# EasyEDA schematic Ouroboros EeasyEDA 1.2.json

## Sheets
1 Leds: TITLE: Ouroboros Looper / Leds; REV: 1.2; Date: 1 Nov 2026; Sheet: 3/4; Drawn By: Alex Kulinchenko; Company: a.kulinchenko8@gmail.com
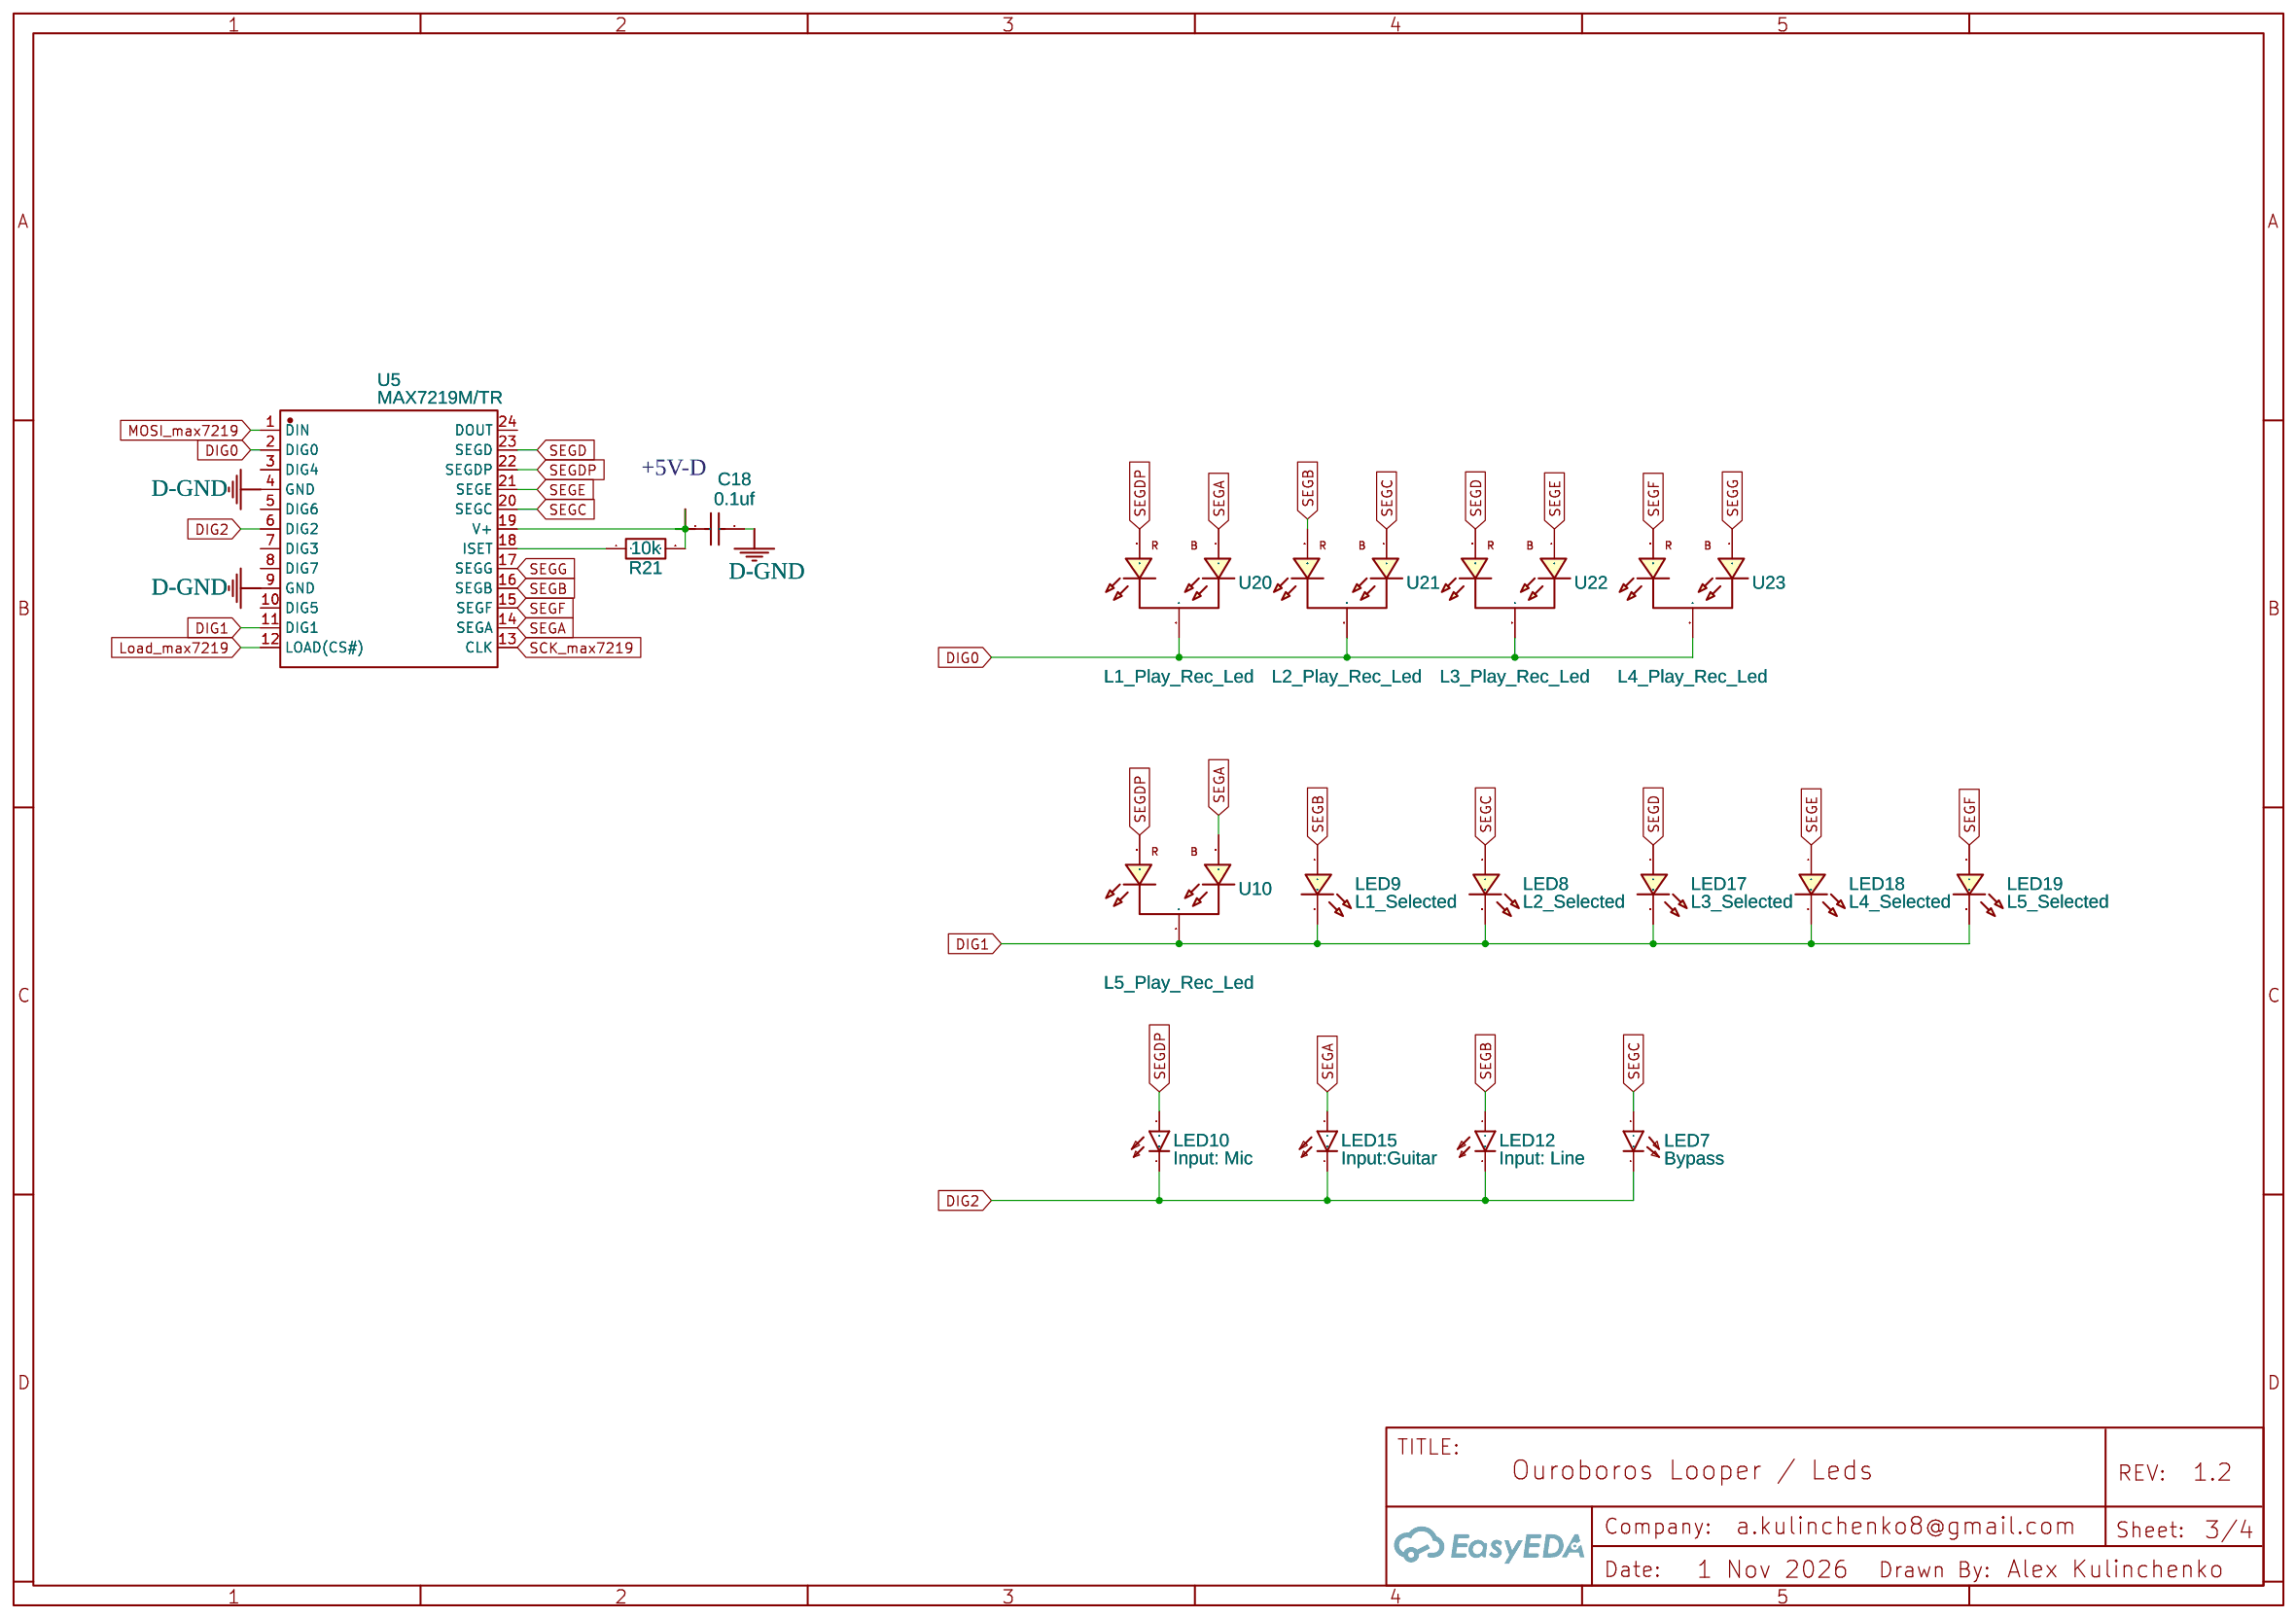
[diagram p0: Leds]
2 In&Out: TITLE: Ouroboros Looper / In and Out; Sheet: 2/4
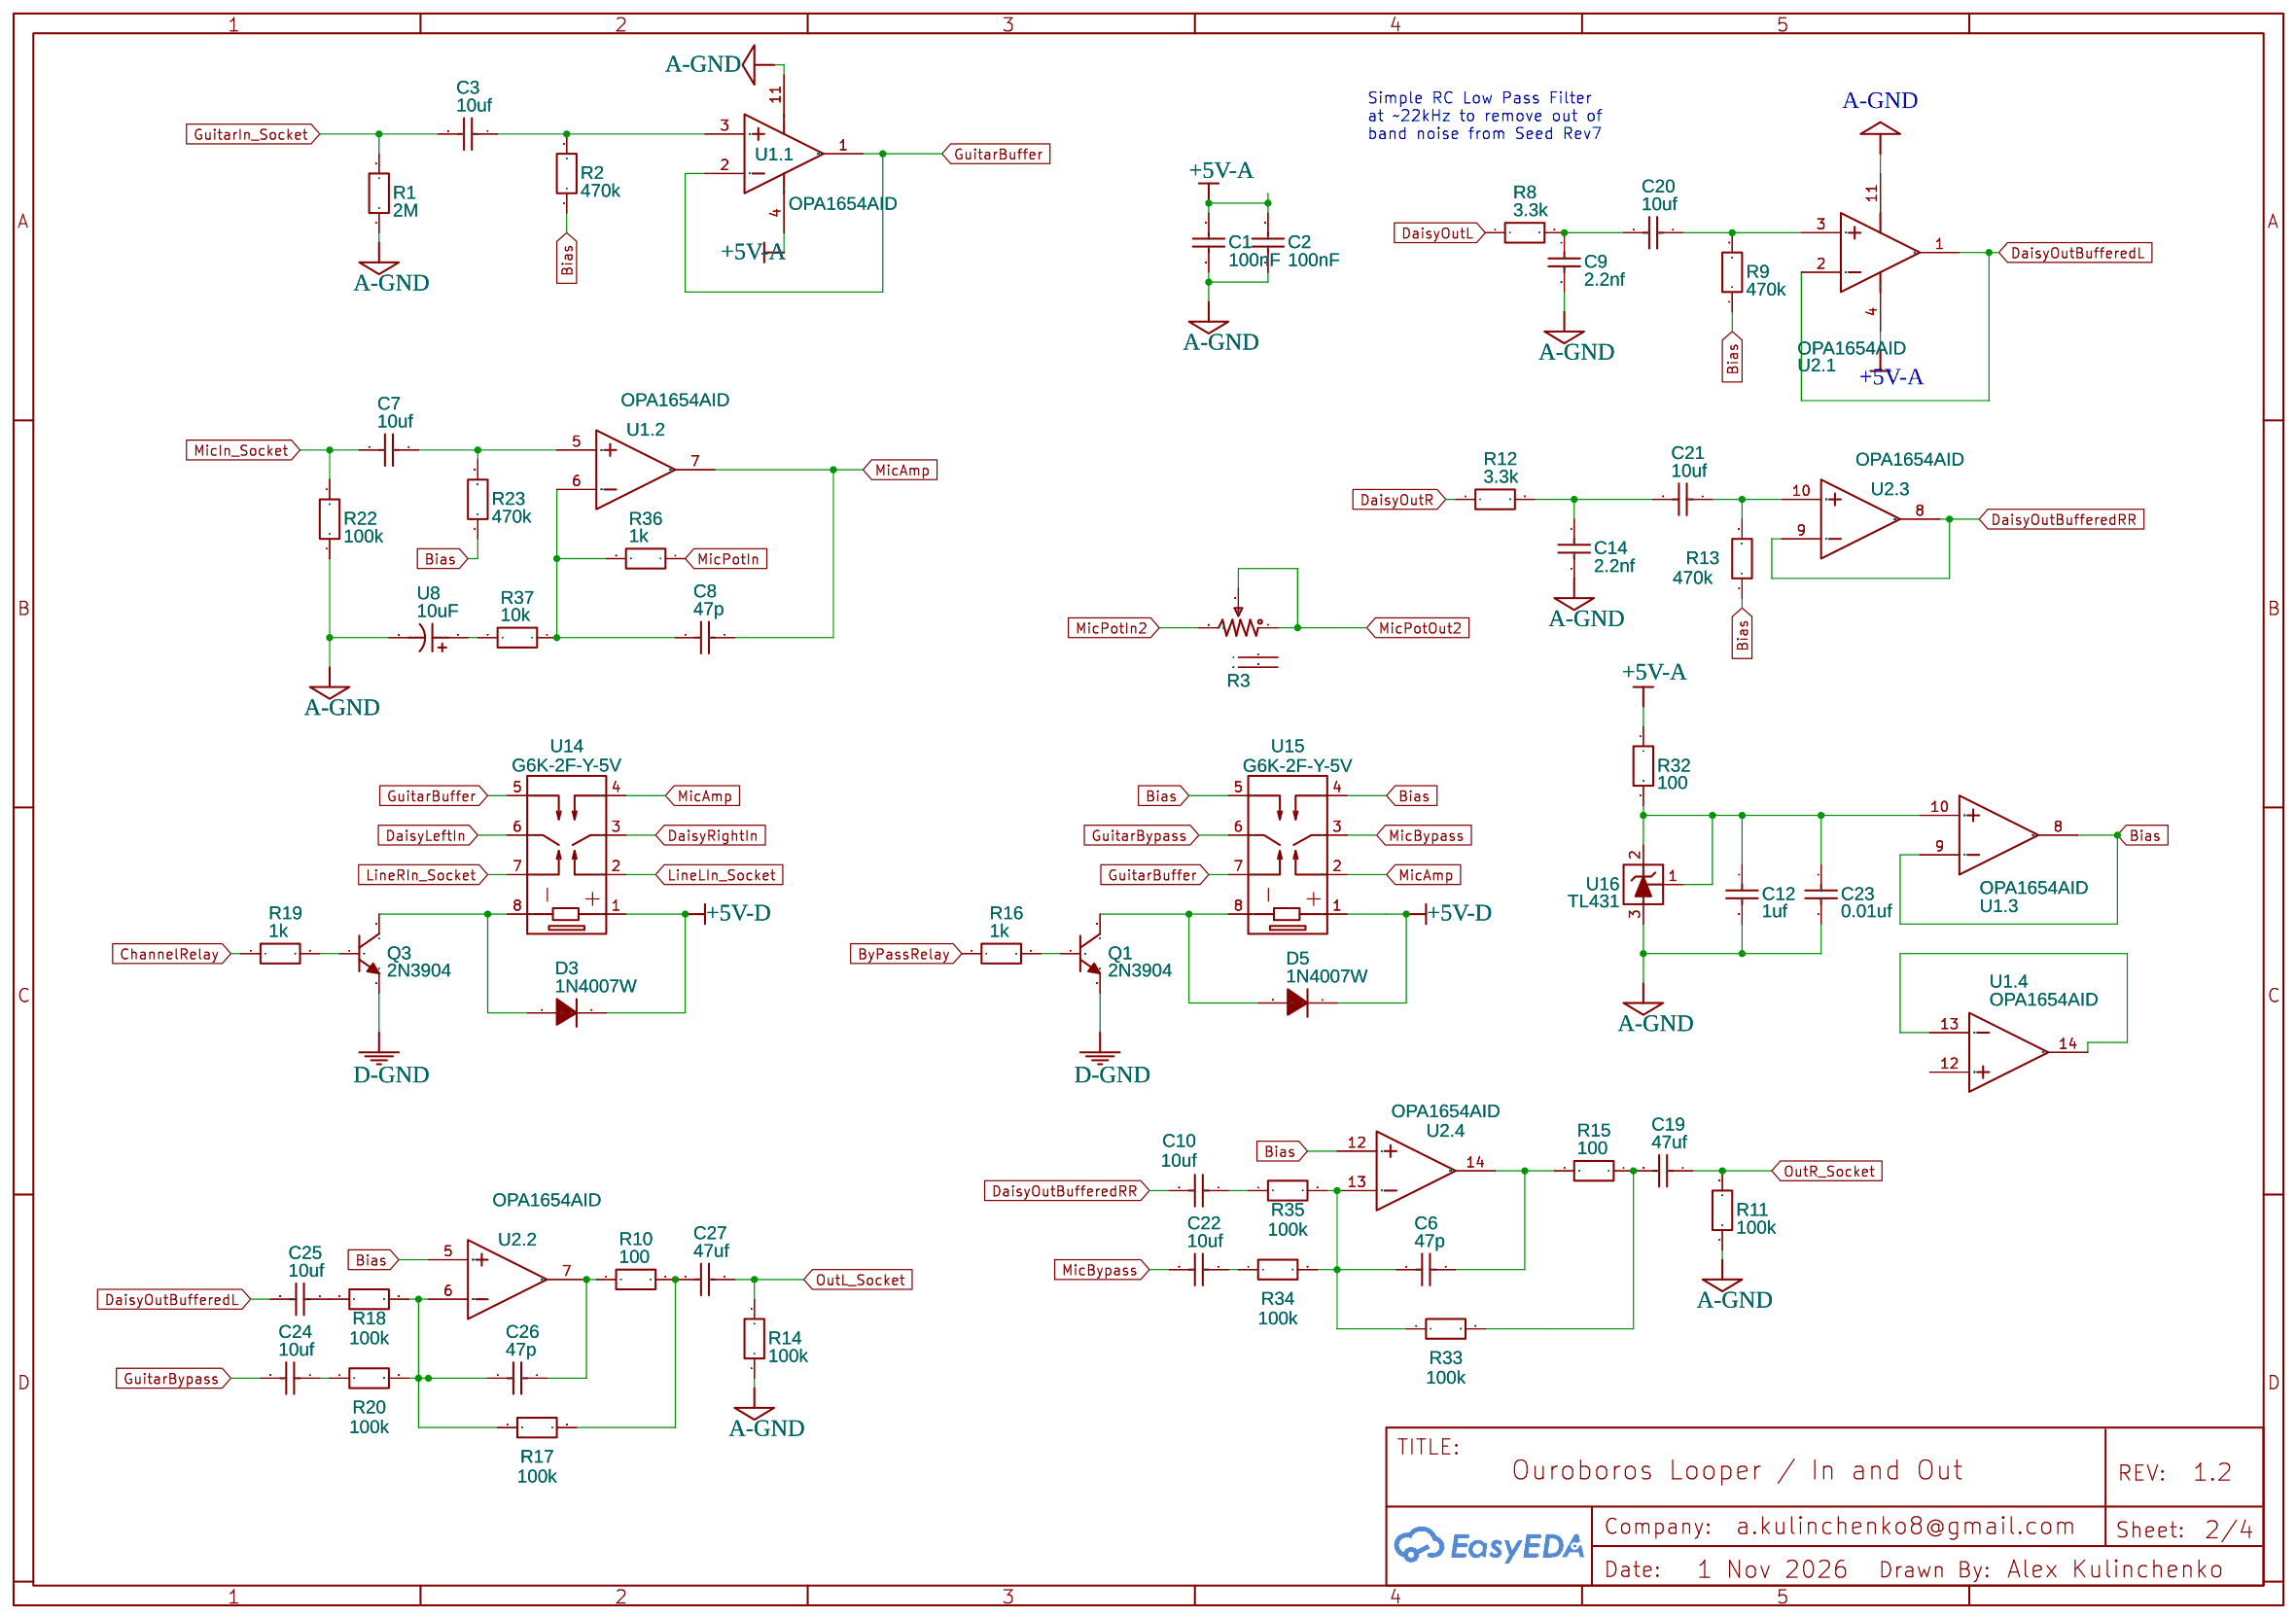
[diagram p1: In&Out]
3 Main: TITLE: Ouroboros Looper / Main; Sheet: 1/4
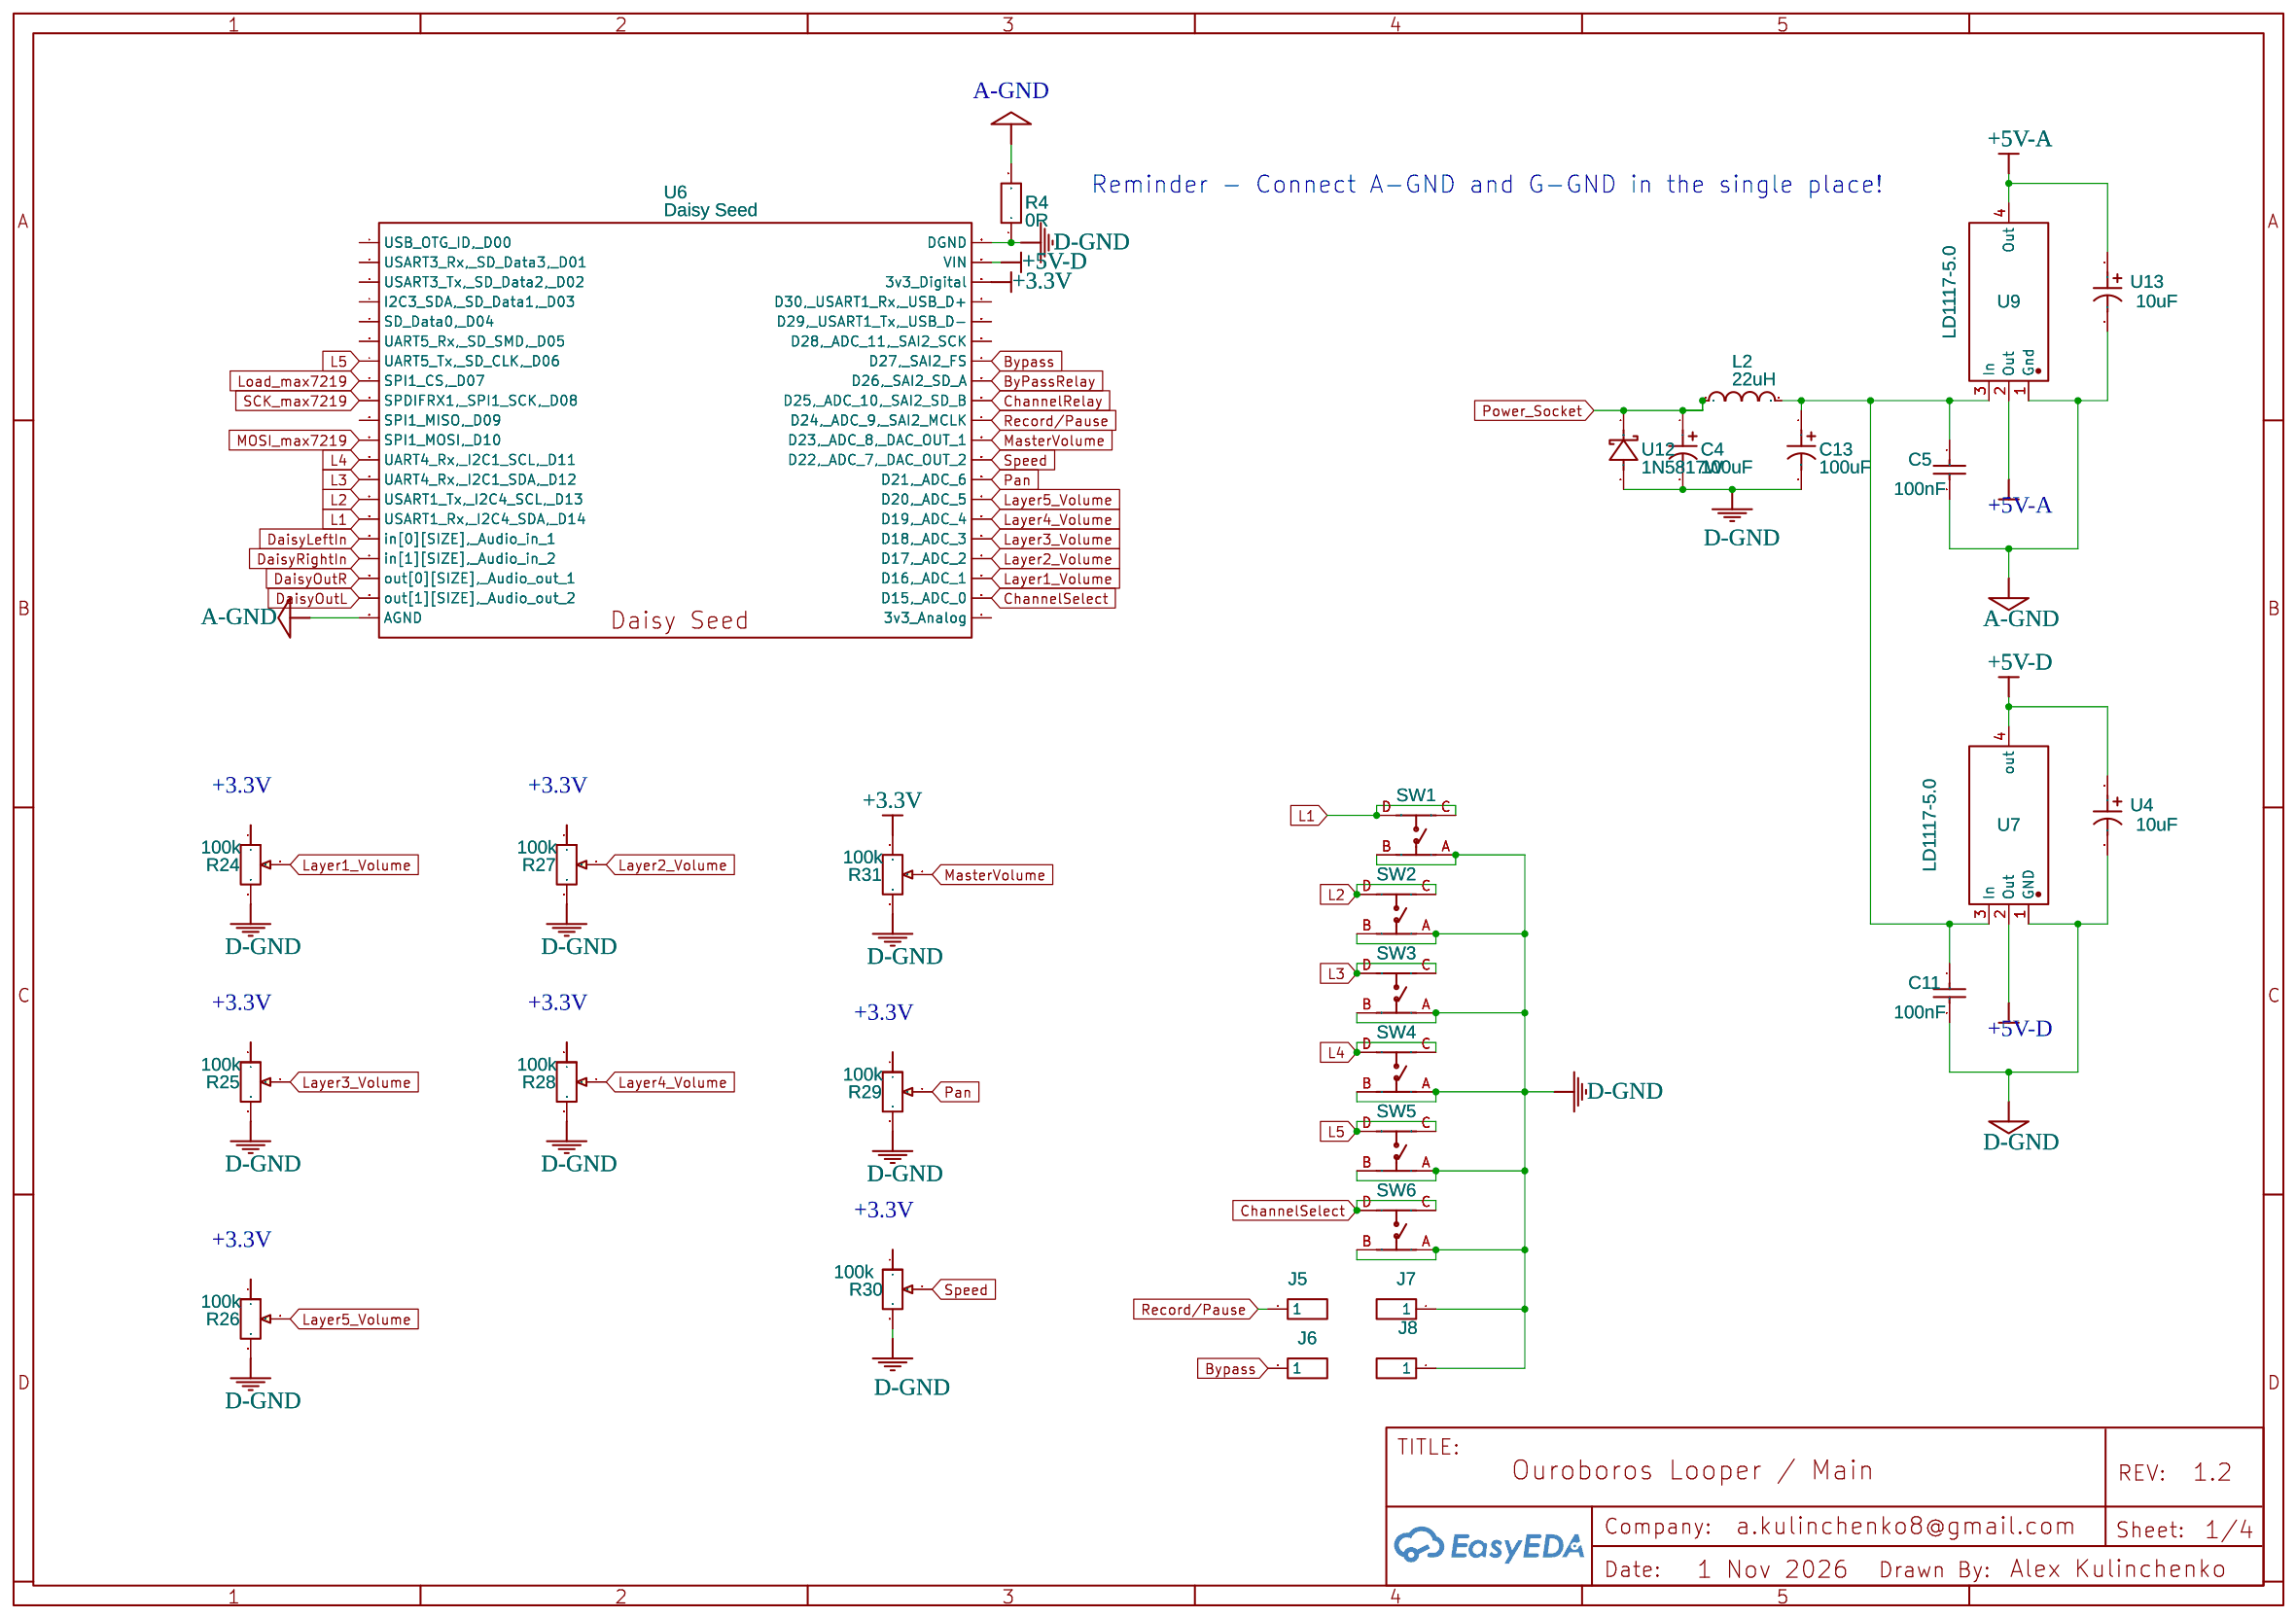
[diagram p2: Main]
4 Sockets: TITLE: Ouroboros Looper / Sockets; Sheet: 4/4
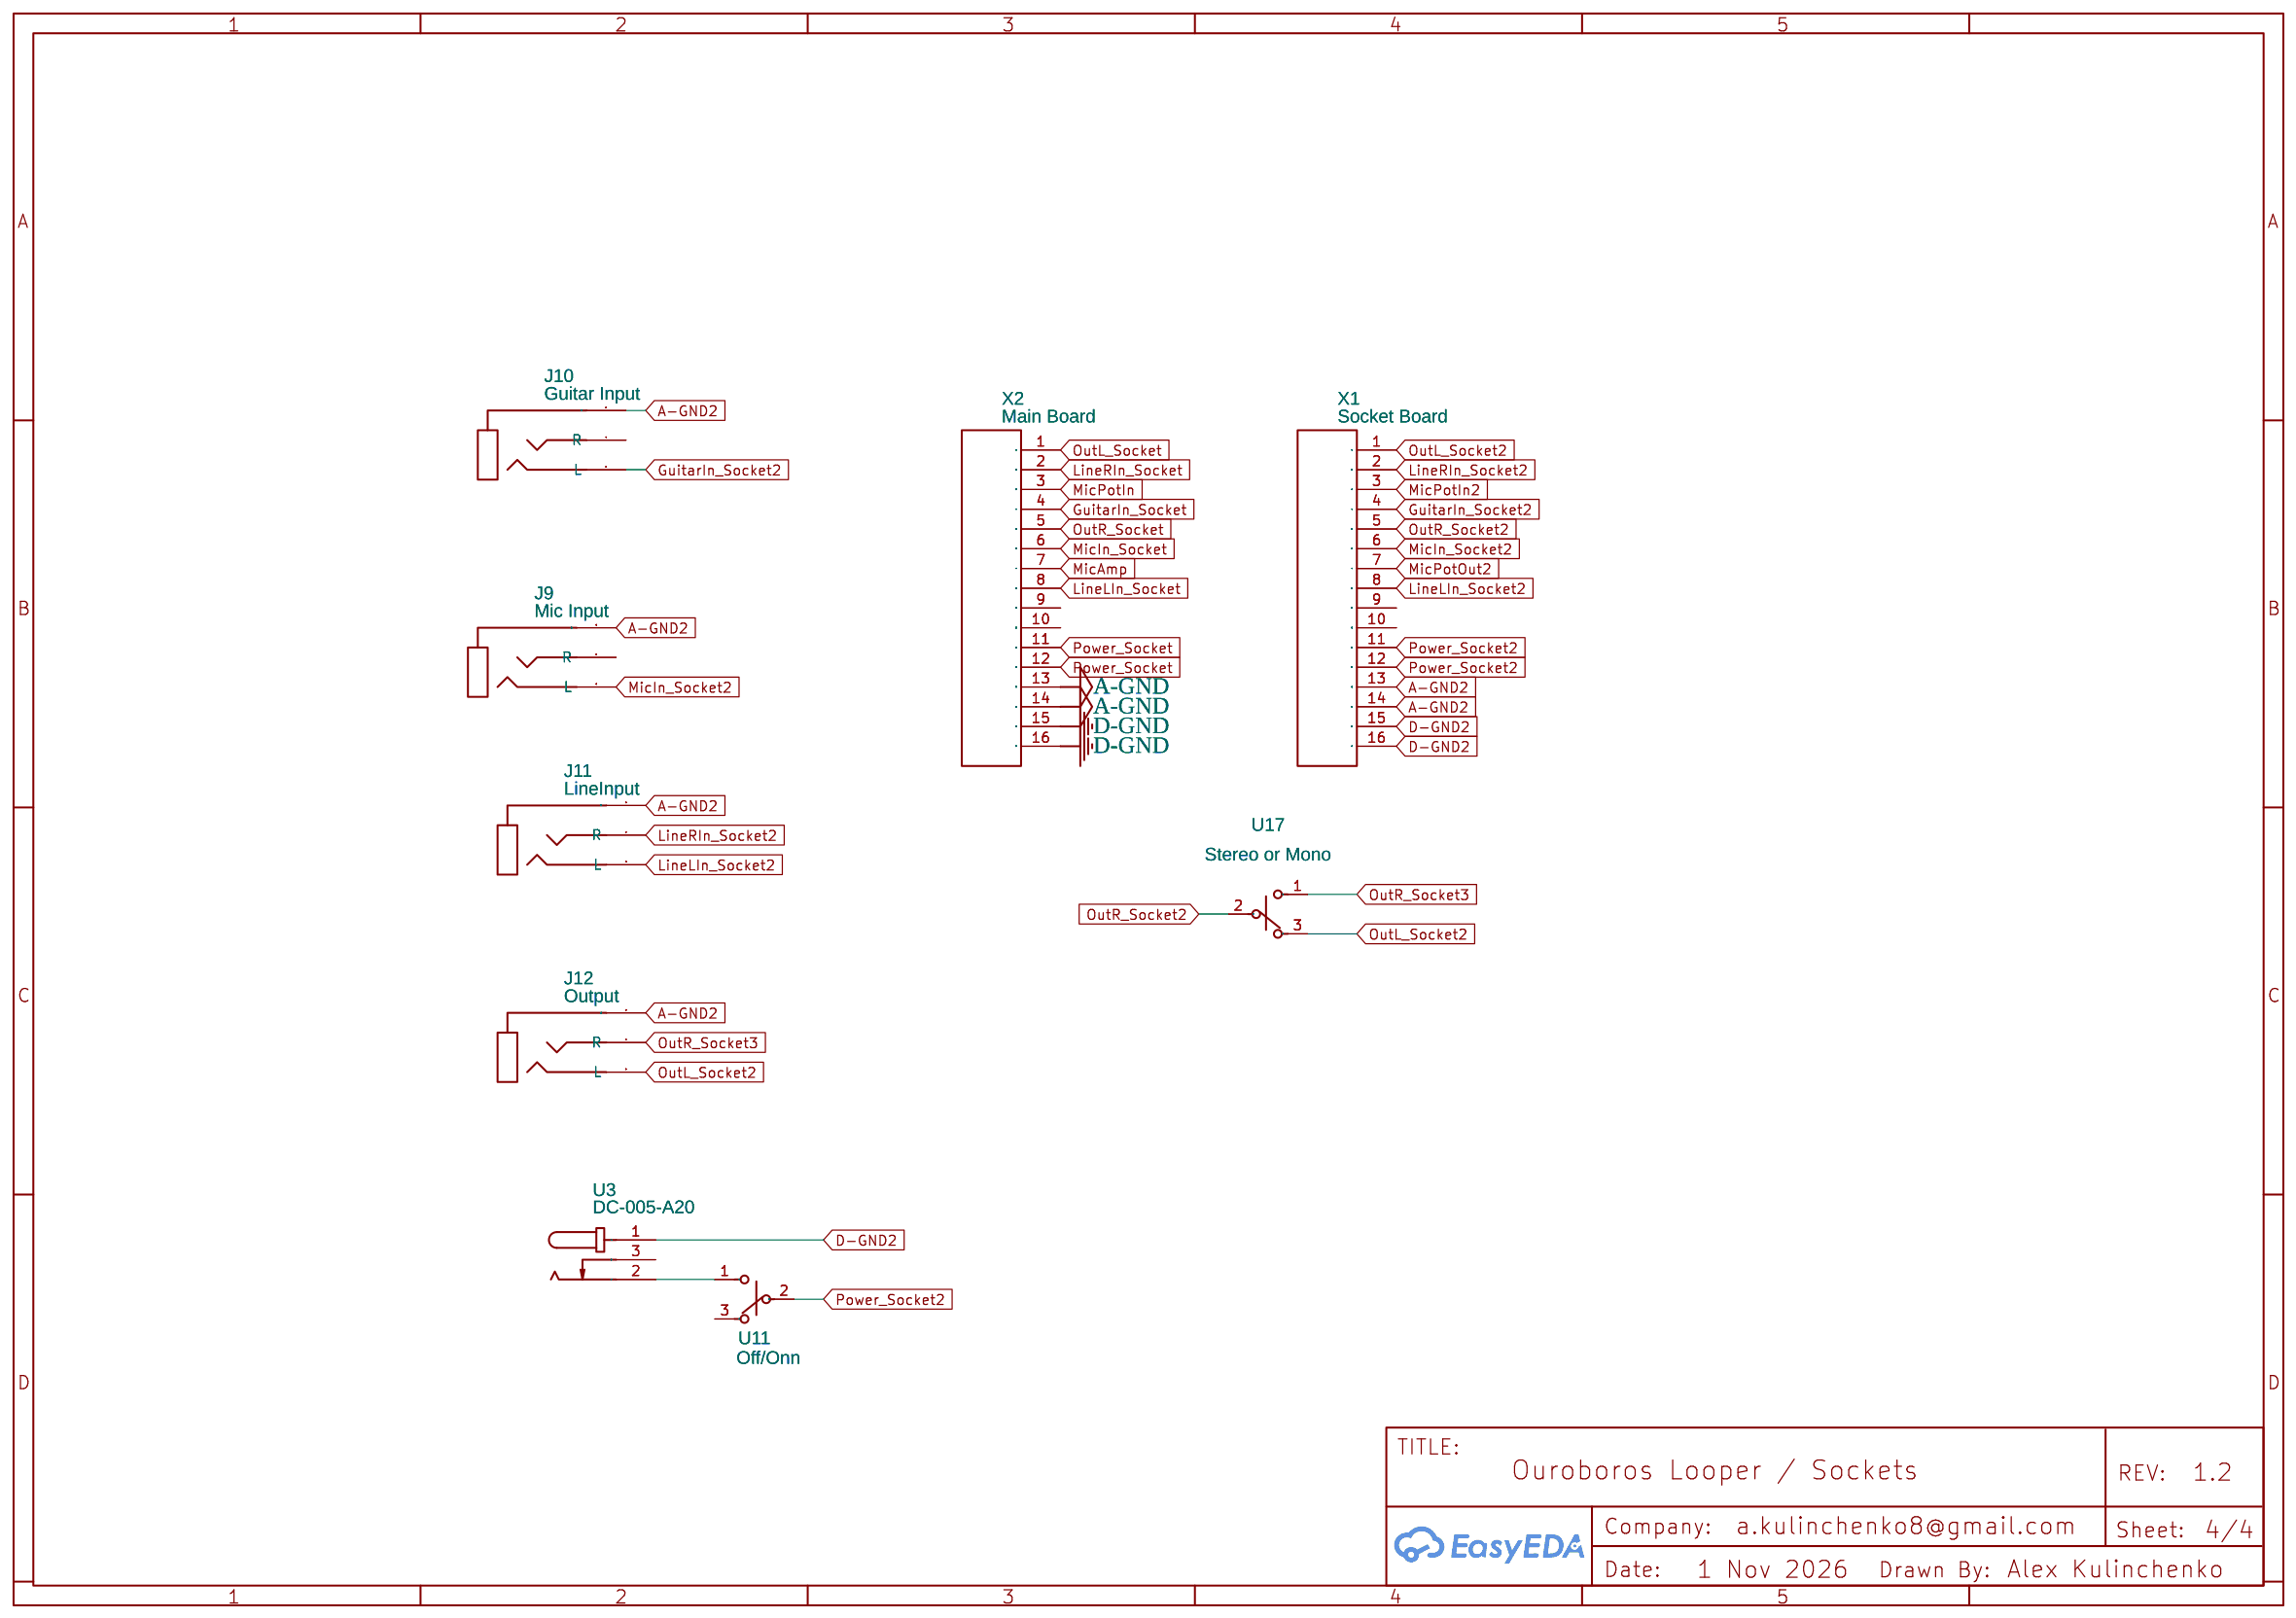
[diagram p3: Sockets]

## Parts
sheet In&Out
C1  100nF  [C0805]
C2  100nF  [C0805]
C3  10uf  [C0805]
C6  47p  [C0805]
C7  10uf  [C0805]
C8  47p  [C0805]
C9  2.2nf  [C0805]
C10  10uf  [C0805]
C12  1uf  [C0805]
C14  2.2nf  [C0805]
C19  47uf  [C0805]
C20  10uf  [C0805]
C21  10uf  [C0805]
C22  10uf  [C0805]
C23  0.01uf  [C0805]
C24  10uf  [C0805]
C25  10uf  [C0805]
C26  47p  [C0805]
C27  47uf  [C0805]
D3  1N4007W  [SOD-123FL_L2.7-W1.8-LS3.8-RD]
D5  1N4007W  [SOD-123FL_L2.7-W1.8-LS3.8-RD]
Q1  2N3904  [SOT-23-3_L3.0-W1.7-P0.95-LS2.9-BR]
Q3  2N3904  [SOT-23-3_L3.0-W1.7-P0.95-LS2.9-BR]
R1  2M  [R0805]
R2  470k  [R0805]
R3  DIP-VR-3P-2.54MM-RV09  [RES-ADJ-TH_DIP-VR-3P-2.54MM-RV09]
R8  3.3k  [R0805]
R9  470k  [R0805]
R10  100  [R0805]
R11  100k  [R0805]
R12  3.3k  [R0805]
R13  470k  [R0805]
R14  100k  [R0805]
R15  100  [R0805]
R16  1k  [R0805]
R17  100k  [R0805]
R18  100k  [R0805]
R19  1k  [R0805]
R20  100k  [R0805]
R22  100k  [R0805]
R23  470k  [R0805]
R32  100  [R0805]
R33  100k  [R0805]
R34  100k  [R0805]
R35  100k  [R0805]
R36  1k  [R0805]
R37  10k  [R0805]
U1  OPA1654AID  [SOIC-14_L8.6-W3.9-P1.27-LS6.0-BL]  (sections 1,2,3,4)
U2  OPA1654AID  [SOIC-14_L8.6-W3.9-P1.27-LS6.0-BL]  (sections 1,2,3,4)
U8  10uF  [CAP-SMD_BD4.0-L4.3-W4.3-LS5.0-FD]
U14  G6K-2F-Y-5V  [RELAY-SMD_G6K-2F-Y]
U15  G6K-2F-Y-5V  [RELAY-SMD_G6K-2F-Y]
U16  TL431  [SOT-23-3_L3.0-W1.6-P1.90-LS2.8-BR]
sheet Leds
C18  0.1uf  [C0805]
LED7  Bypass  [LED_LED3MM]
LED8  L2_Selected  [LED-TH_BD5.0_RED]
LED9  L1_Selected  [LED-TH_BD5.0_RED]
LED10  Input: Mic  [LED_LED3MM]
LED12  Input: Line  [LED_LED3MM]
LED15  Input:Guitar  [LED_LED3MM]
LED17  L3_Selected  [LED-TH_BD5.0_RED]
LED18  L4_Selected  [LED-TH_BD5.0_RED]
LED19  L5_Selected  [LED-TH_BD5.0_RED]
R21  10k  [R0805]
U5  MAX7219M/TR  [SOP-24_L15.4-W7.5-P1.27-LS10.4-BL]
U10  L5_Play_Rec_Led  [DUAL LED COMMON CATHODE R/B]
U20  L1_Play_Rec_Led  [DUAL LED COMMON CATHODE R/B]
U21  L2_Play_Rec_Led  [DUAL LED COMMON CATHODE R/B]
U22  L3_Play_Rec_Led  [DUAL LED COMMON CATHODE R/B]
U23  L4_Play_Rec_Led  [DUAL LED COMMON CATHODE R/B]
sheet Main
C4  100uF  [CAP-SMD_BD6.3-L6.6-W6.6-LS7.2-FD]
C5  100nF  [C0805]
C11  100nF  [C0805]
C13  100uF  [CAP-SMD_BD6.3-L6.6-W6.6-LS7.2-FD]
J5  HDR-M-2.54_1x1  [HDR-M-2.54_1X1]
J6  HDR-M-2.54_1x1  [HDR-M-2.54_1X1]
J7  HDR-M-2.54_1x1  [HDR-M-2.54_1X1]
J8  HDR-M-2.54_1x1  [HDR-M-2.54_1X1]
L2  22uH  [IND-SMD_L5.0-W5.0_LVS505040]
R4  0R  [R1206]
R24  100k  [9MM_SNAP-IN_POT]
R25  100k  [9MM_SNAP-IN_POT]
R26  100k  [9MM_SNAP-IN_POT]
R27  100k  [9MM_SNAP-IN_POT]
R28  100k  [9MM_SNAP-IN_POT]
R29  100k  [9MM_SNAP-IN_POT]
R30  100k  [9MM_SNAP-IN_POT]
R31  100k  [9MM_SNAP-IN_POT]
SW1  L1  [SW-TH_SH-6X6X4.3H-CJ]
SW2  L2  [SW-TH_SH-6X6X4.3H-CJ]
SW3  L3  [SW-TH_SH-6X6X4.3H-CJ]
SW4  L4  [SW-TH_SH-6X6X4.3H-CJ]
SW5  L5  [SW-TH_SH-6X6X4.3H-CJ]
SW6  Channel  [SW-TH_SH-6X6X4.3H-CJ]
U4  10uF  [CAP-SMD_BD5.0-L5.3-W5.3-LS5.5-FD]
U6  Daisy Seed  [DAISY_SEED]
U7  LD1117-5.0  [SOT-223_L6.7-W3.5-P2.30-BR]
U9  LD1117-5.0  [SOT-223_L6.7-W3.5-P2.30-BR]
U12  1N5817W  [SOD-123_L2.8-W1.6-LS3.7-RD]
U13  10uF  [CAP-SMD_BD5.0-L5.3-W5.3-LS5.5-FD]
sheet Sockets
J9  Mic Input  [ST-008 SHORT]
J10  Guitar Input  [ST-008 SHORT]
J11  LineInput  [ST-008 SHORT]
J12  Output  [ST-008 SHORT]
U3  DC-005-A20  [DC-IN-TH_DC-005-A200]
U11  Off/Onn  [MTS-102-C4 ON-ON SPDT 3P]
U17  Stereo or Mono  [MTS-102-C4 ON-ON SPDT 3P]
X1  Socket Board  [IDC 16PIN]
X2  Main Board  [IDC 16PIN]

## Library data of the parts
C1-C3 C5-C12 C14 C18-C27 = 100nF: Supplier: LCSC; Manufacturer: ReliaPro; Manufacturer Part: CT4-0805Y104M500; Contributor: LCSC; Supplier Part: C46756
D3 D5 = 1N4007W: Supplier: LCSC; Manufacturer: 晶导微电子; Supplier Part: C108803; JLCPCB Part Class: Extended Part
Q1 Q3 = 2N3904S-HXY: Supplier: LCSC; Supplier Part: C46682376; Manufacturer: HXY MOSFET(华轩阳电子); JLCPCB Part Class: Extended Part; Contributor: lcsc
R1 = R_AXIAL-0.4_EU: Supplier Part: C325853; Supplier: LCSC; Contributor: LCEDA_Lib; Manufacturer Part: RMC 0805 2M J N; Manufacturer: Tyohm(幸亚电阻)
R2 R9 R13 R23 = R_AXIAL-0.4_EU: Supplier Part: C136922; Supplier: LCSC; Contributor: LCEDA_Lib; Manufacturer Part: RT0805BRD07470KL; Manufacturer: YAGEO(国巨)
R3 = DIP-VR-3P-2.54MM-RV09: Contributor: lcsc; Supplier: LCSC; Supplier Part: C9900014641; Manufacturer: null; JLCPCB Part Class: Extended Part
R8 R12 = R_AXIAL-0.4_EU: Supplier Part: C269541; Supplier: LCSC; Contributor: LCEDA_Lib; Manufacturer Part: RMC08053.3K1%N; Manufacturer: Tyohm(幸亚电阻)
R10 R15 R32 = R_AXIAL-0.4_EU: Supplier Part: C3008930; Supplier: LCSC; Contributor: LCEDA_Lib; Manufacturer Part: CRCW0805100RJNEAC; Manufacturer: VISHAY(威世)
R11 R14 R17 R18 R20 R22 R33-R35 = R_AXIAL-0.4_EU: Supplier Part: C328379; Supplier: LCSC; Contributor: LCEDA_Lib; Manufacturer Part: AECR0805F100KK9; Manufacturer: RESI(开步睿思)
R16 R19 R36 R37 = R_AXIAL-0.4_EU: Supplier Part: C17513; Supplier: LCSC; Contributor: LCEDA_Lib; Manufacturer Part: 0805W8F1001T5E; Manufacturer: UNI-ROYAL(厚声)
U1 U2 = OPA1654AID: subpart_no: 1; Supplier: LCSC; Supplier Part: C2878588; Manufacturer: TI(德州仪器); JLCPCB Part Class: Extended Part
U8 = 126RV0157: Supplier: LCSC; Supplier Part: C7461288; Manufacturer: KNSCHA(科尼盛); JLCPCB Part Class: Extended Part; Contributor: lcsc
U14 U15 = G6K-2F-Y-5V_C2982926: Contributor: lcsc; Supplier: LCSC; Supplier Part: C2982926; Manufacturer: OMRON(欧姆龙); JLCPCB Part Class: Extended Part
U16 = TL431-SOT-23: Supplier: LCSC; Supplier Part: C50229486; Manufacturer: DDF(鼎德丰); Contributor: lcsc; JLCPCB Part Class: Extended Part
LED7 LED10 LED12 LED15 = LED_LED3MM: Contributor: titiyanee.saw
LED8 LED9 LED17-LED19 = LED-TH-5mm_R: Manufacturer: EVERLIGHT(台湾亿光); Manufacturer Part: 333-2SURD/S530-A3; Supplier Part: C87271; Supplier: LCSC; Contributor: LCEDA_Lib
R21 = R_AXIAL-0.4_EU: Supplier Part: C3016734; Supplier: LCSC; Contributor: LCEDA_Lib; Manufacturer Part: SCR0805F10K; Manufacturer: VO(翔胜)
U5 = MAX7219M/TR: Supplier: LCSC; Supplier Part: C6705351; Manufacturer: HGSEMI(华冠); JLCPCB Part Class: Extended Part; Contributor: lcsc
U10 U20-U23 = DUAL LED COMMON CATHODE R/B: Contributor: jmsfcx
C4 C13 = RVT100UF16V67RV0016: Contributor: LCSC; Supplier: LCSC; Supplier Part: C2887276; Manufacturer: KNSCHA(科尼盛); JLCPCB Part Class: Extended Part
J5-J8 = HDR-M-2.54_1x1: Supplier Part: C81276; Supplier: LCSC; Contributor: LCEDA_Lib
L2 = LVS505020-220M-N: Supplier: LCSC; Manufacturer: Chilisin(奇力新); Supplier Part: C142123; JLCPCB Part Class: Extended Part
R4 = R_1206_EU: Supplier Part: C5127787; Supplier: LCSC; Contributor: LCEDA_Lib; Manufacturer Part: HoT1206D-0R; Manufacturer: Milliohm(毫欧)
R24-R31 = R_3386P_EU: Supplier Part: C5140188; Supplier: LCSC; Manufacturer Part: SCR0805J10K; Contributor: LCEDA_Lib; Value(Ω): 10K; Manufacturer: VO(翔胜)
SW1-SW6 = SH-6X6X4.3H-CJ: Supplier: LCSC; Supplier Part: C42416242; Manufacturer: SHOU HAN(首韩); Contributor: lcsc; JLCPCB Part Class: Extended Part
U4 U13 = VZ1V100MC054000CE0: Supplier: LCSC; Supplier Part: C2912512; Manufacturer: HUAWEI(华威集团); Contributor: lcsc; JLCPCB Part Class: Extended Part
U6 = Daisy Seed: Contributor: jjmens
U7 U9 = LD1117-5.0: Contributor: LCSC; Supplier: LCSC; Supplier Part: C347230; Manufacturer: UMW(友台半导体); JLCPCB Part Class: Extended Part
U12 = 1N5817W_C19184667: Supplier: LCSC; Supplier Part: C19184667; Manufacturer: XCH(旭昌辉); Contributor: lcsc; JLCPCB Part Class: Extended Part
J9-J12 = ST-008: Contributor: bo4onokx
U3 = DC-005-A20: Supplier: LCSC; Supplier Part: C19077752; Manufacturer: Yuandi(元迪); Contributor: lcsc; JLCPCB Part Class: Extended Part
U11 U17 = MTS-102: Manufacturer: НЕТ; Supplier Part: НЕТ; link: НЕТ; Contributor: evgeniymaster
X1 X2 = IDC_16PIN_THT COPY: Manufacturer: CONNFLY; Manufacturer Part: ZL231-14PG; Supplier: TME; Supplier Part: ZL231-14PG; Contributor: michalklis

## Nets
+3.3V: R24.1 R25.1 R26.1 R27.1 R28.1 R29.1 R30.1 R31.1 U6.38(3v3 Digital)
+5V-A: C1.2 C2.2 R32.1 U1.4(V+) U2.4(V+) U9.2(Out) U9.4(Out) U13.1
+5V-D: C18.1 D3.1(K) D5.1(K) R21.2 U4.1 U5.19(V+) U6.39(VIN) U7.2(Out) U7.4(out) U14.1 U15.1
A-GND: C1.1 C2.1 C5.2 C9.2 C12.2 C14.2 C23.2 R1.1 R4.2 R11.1 R14.1 R22.1 U1.11(V-) U2.11(V-) U6.20(AGND) U8.2 U9.1(Gnd) U13.2 U16.3(A) X2.13 X2.14
A-GND2: J9.3(Gnd) J10.3(Gnd) J11.3(Gnd) J12.3(Gnd) X1.13 X1.14
Bias: R2.1 R9.1 R13.1 R23.1 U1.8(OUT C) U1.9(IN C-) U2.5(IN B+) U2.12(IN D+) U15.4 U15.5
Bypass: J6.1 U6.34(D27, SAI2 FS)
ByPassRelay: R16.1 U6.33(D26, SAI2 SD A)
ChannelRelay: R19.1 U6.32(D25, ADC 10, SAI2 SD B)
ChannelSelect: SW6.C SW6.D U6.22(D15, ADC 0)
D-GND: C4.2 C11.2 C13.2 C18.2 J7.1 J8.1 Q1.2(E) Q3.2(E) R4.1 R24.3 R25.3 R26.3 R27.3 R28.3 R29.3 R30.3 R31.3 SW1.A SW1.B SW2.A SW2.B SW3.A SW3.B SW4.A SW4.B SW5.A SW5.B SW6.A SW6.B U4.2 U5.4(GND) U5.9(GND) U6.40(DGND) U7.1(GND) U12.2(A) X2.15(14) X2.16(14)
D-GND2: U3.1 X1.15(14) X1.16(14)
DaisyLeftIn: U6.16(in[0][SIZE], Audio in 1) U14.6
DaisyOutBufferedL: C25.2 U2.1(OUT A) U2.2(IN A-)
DaisyOutBufferedRR: C10.2 U2.8(OUT C) U2.9(IN C-)
DaisyOutL: R8.1 U6.19(out[1][SIZE], Audio out 2)
DaisyOutR: R12.1 U6.18(out[0][SIZE], Audio out 1)
DaisyRightIn: U6.17(in[1][SIZE], Audio in 2) U14.3
DIG0: U5.2(DIG0) U20.2 U21.2 U22.2 U23.2
DIG1: LED8.2 LED9.2 LED17.2 LED18.2 LED19.2 U5.11(DIG1) U10.2
DIG2: LED7.K(C) LED10.K(C) LED12.K(C) LED15.K(C) U5.6(DIG2)
GuitarBuffer: U1.1(OUT A) U1.2(IN A-) U14.5 U15.7
GuitarBypass: C24.2 U15.6
GuitarIn_Socket: C3.2 R1.2 X2.4
GuitarIn_Socket2: J10.2(L) X1.4
L1: SW1.C SW1.D U6.15(USART1 Rx, I2C4 SDA, D14)
L2: SW2.C SW2.D U6.14(USART1 Tx, I2C4 SCL, D13)
L3: SW3.C SW3.D U6.13(UART4 Rx, I2C1 SDA, D12)
L4: SW4.C SW4.D U6.12(UART4 Rx, I2C1 SCL, D11)
L5: SW5.C SW5.D U6.7(UART5 Tx, SD CLK, D06)
Layer1_Volume: R24.2 U6.23(D16, ADC 1)
Layer2_Volume: R27.2 U6.24(D17, ADC 2)
Layer3_Volume: R25.2 U6.25(D18, ADC 3)
Layer4_Volume: R28.2 U6.26(D19, ADC 4)
Layer5_Volume: R26.2 U6.27(D20, ADC 5)
LineLIn_Socket: U14.2 X2.8
LineLIn_Socket2: J11.2(L) X1.8
LineRIn_Socket: U14.7 X2.2
LineRIn_Socket2: J11.1(R) X1.2
Load_max7219: U5.12(LOAD(CS#)) U6.8(SPI1 CS, D07)
MasterVolume: R31.2 U6.30(D23, ADC 8, DAC OUT 1)
MicAmp: C8.1 U1.7(OUT B) U14.4 U15.2 X2.7
MicBypass: C22.2 U15.3
MicIn_Socket: C7.2 R22.2 X2.6
MicIn_Socket2: J9.2(L) X1.6
MicPotIn: R36.1 X2.3
MicPotIn2: R3.3 X1.3
MicPotOut2: R3.1 R3.2 X1.7
MOSI_max7219: U5.1(DIN) U6.11(SPI1 MOSI, D10)
OutL_Socket: C27.1 R14.2 X2.1
OutL_Socket2: J12.2(L) U17.3 X1.1
OutR_Socket: C19.1 R11.2 X2.5
OutR_Socket2: U17.2 X1.5
OutR_Socket3: J12.1(R) U17.1
Pan: R29.2 U6.28(D21, ADC 6)
Power_Socket: C4.1 L2.1 U12.1(C) X2.11 X2.12
Power_Socket2: U11.2 X1.11 X1.12
Record/Pause: J5.1 U6.31(D24, ADC 9, SAI2 MCLK)
SCK_max7219: U5.13(CLK) U6.9(SPDIFRX1, SPI1 SCK, D08)
SEGA: LED15.A U5.14(SEGA) U10.1 U20.1
SEGB: LED9.1 LED12.A U5.16(SEGB) U21.3
SEGC: LED7.A LED8.1 U5.20(SEGC) U21.1
SEGD: LED17.1 U5.23(SEGD) U22.3
SEGDP: LED10.A U5.22(SEGDP) U10.3 U20.3
SEGE: LED18.1 U5.21(SEGE) U22.1
SEGF: LED19.1 U5.15(SEGF) U23.3
SEGG: U5.17(SEGG) U23.1
Speed: R30.2 U6.29(D22, ADC 7, DAC OUT 2)
Net-(C3-1): C3.1 R2.2 U1.3(IN A+)
Net-(C5-1): C5.1 C11.1 C13.1 L2.2 U7.3(In) U9.3(In)
Net-(C6-1): C6.1 R15.2 U2.14(OUT D)
Net-(C6-2): C6.2 R33.1 R34.2 R35.2 U2.13(IN D-)
Net-(C7-1): C7.1 R23.2 U1.5(IN B+)
Net-(C8-2): C8.2 R36.2 R37.1 U1.6(IN B-)
Net-(C9-1): C9.1 C20.2 R8.2
Net-(C10-1): C10.1 R35.1
Net-(C12-1): C12.1 C23.1 R32.2 U1.10(IN C+) U16.1(R) U16.2(C)
Net-(C14-1): C14.1 C21.2 R12.2
Net-(C19-2): C19.2 R15.1 R33.2
Net-(C20-1): C20.1 R9.2 U2.3(IN A+)
Net-(C21-1): C21.1 R13.2 U2.10(IN C+)
Net-(C22-1): C22.1 R34.1
Net-(C24-1): C24.1 R20.1
Net-(C25-1): C25.1 R18.1
Net-(C26-1): C26.1 R10.2 U2.7(OUT B)
Net-(C26-2): C26.2 R17.1 R18.2 R20.2 U2.6(IN B-)
Net-(C27-2): C27.2 R10.1 R17.2
Net-(D3-2): D3.2(A) Q3.3(C) U14.8
Net-(D5-2): D5.2(A) Q1.3(C) U15.8
Net-(Q1-1): Q1.1(B) R16.2
Net-(Q3-1): Q3.1(B) R19.2
Net-(R21-1): R21.1 U5.18(ISET)
Net-(R37-2): R37.2 U8.1
Net-(U1.4-13): U1.13(IN D-) U1.14(OUT D)
Net-(U3-2): U3.2 U11.1

Not connected (* = marked no-connect by the designer): J9 1(R); J10 1(R); R3 4 5; U1 12(IN D+); U3 3; U5 3(DIG4) 5(DIG6) 7(DIG3) 8(DIG7) 10(DIG5) 24(DOUT); U6 1(USB OTG ID, D00) 2(USART3 Rx, SD Data3, D01) 3(USART3 Tx, SD Data2, D02) 4(I2C3 SDA, SD Data1, D03) 5(SD Data0, D04) 6(UART5 Rx, SD SMD, D05) 10(SPI1 MISO, D09) 21(3v3 Analog) 35(D28, ADC 11, SAI2 SCK) 36(D29, USART1 Tx, USB D-) 37(D30, USART1 Rx, USB D+); U11 3; X1 9 10; X2 9 10

## Notes on the sheets
sheet 2
- Simple RC Low Pass Filter
  at ~22kHz to remove out of
  band noise from Seed Rev7
sheet 3
- Reminder - Connect A-GND and G-GND in the single place!
